# EAGLE design ou6_cs-base V1.0 (EAGLE 7.6.0)
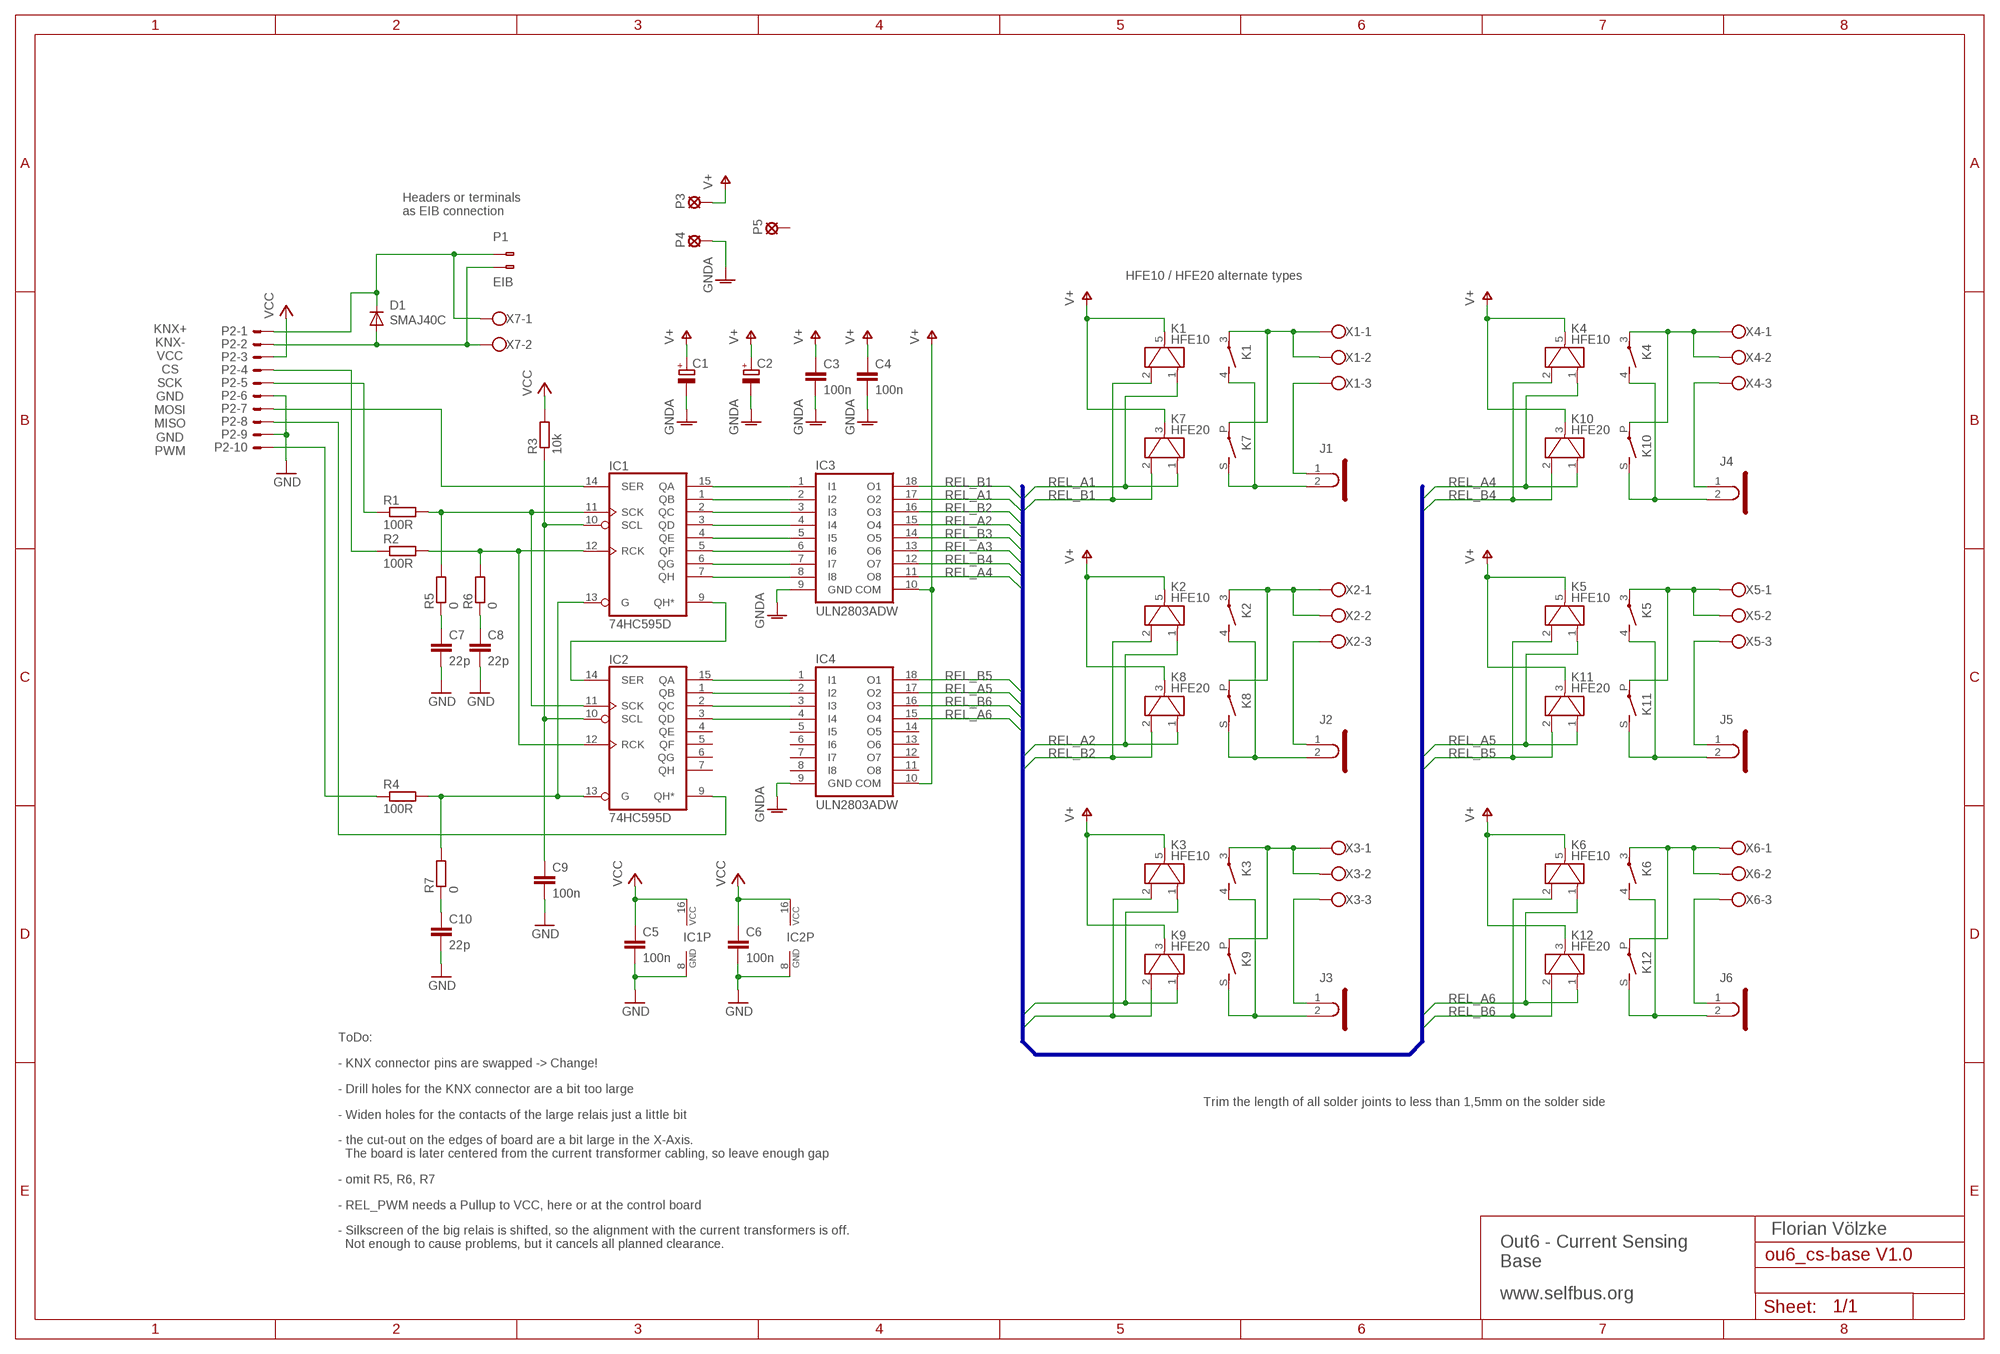
[diagram p0: schematic, sheet 1]

## Parts
C1  CPOL-EUE5-13-20  [E5-13-20]
C2  CPOL-EUE5-13-20R  [E5-13-20R]
C3  100n  C-EUC0805M  [R0805M]
C4  100n  C-EUC0805M  [R0805M]
C5  100n  C-EUC0805M  [R0805M]
C6  100n  C-EUC0805M  [R0805M]
C7  22p  C-EUC0805M  [R0805M]
C8  22p  C-EUC0805M  [R0805M]
C9  100n  C-EUC0805M  [R0805M]
C10  22p  C-EUC0805M  [R0805M]
D1  SMAJ40C  D-SMB  [SMB]
IC1  74HC595D  [SO16]
IC2  74HC595D  [SO16]
IC3  ULN2803ADW  [SO18W]
IC4  ULN2803ADW  [SO18W]
J1  IXFORMER_PRIMONLY  [IXFORMERANTIPART]
J2  IXFORMER_PRIMONLY  [IXFORMERANTIPART]
J3  IXFORMER_PRIMONLY  [IXFORMERANTIPART]
J4  IXFORMER_PRIMONLY  [IXFORMERANTIPART]
J5  IXFORMER_PRIMONLY  [IXFORMERANTIPART]
J6  IXFORMER_PRIMONLY  [IXFORMERANTIPART]
K1  HFE10  BISTABLE2C_PCB_SNGLPINHFE10  [PCB_REL_BIG_POWER_NO]
K2  HFE10  BISTABLE2C_PCB_SNGLPINHFE10  [PCB_REL_BIG_POWER_NO]
K3  HFE10  BISTABLE2C_PCB_SNGLPINHFE10  [PCB_REL_BIG_POWER_NO]
K4  HFE10  BISTABLE2C_PCB_SNGLPINHFE10  [PCB_REL_BIG_POWER_NO]
K5  HFE10  BISTABLE2C_PCB_SNGLPINHFE10  [PCB_REL_BIG_POWER_NO]
K6  HFE10  BISTABLE2C_PCB_SNGLPINHFE10  [PCB_REL_BIG_POWER_NO]
K7  HFE20  BISTABLE2C_PCB_SNGLPINHFE20  [PCB_REL_HP_NO_SNGLPIN]
K8  HFE20  BISTABLE2C_PCB_SNGLPINHFE20  [PCB_REL_HP_NO_SNGLPIN]
K9  HFE20  BISTABLE2C_PCB_SNGLPINHFE20  [PCB_REL_HP_NO_SNGLPIN]
K10  HFE20  BISTABLE2C_PCB_SNGLPINHFE20  [PCB_REL_HP_NO_SNGLPIN]
K11  HFE20  BISTABLE2C_PCB_SNGLPINHFE20  [PCB_REL_HP_NO_SNGLPIN]
K12  HFE20  BISTABLE2C_PCB_SNGLPINHFE20  [PCB_REL_HP_NO_SNGLPIN]
P1  EIB  [BUSKLEMME243-724]
P2  ML10E  [ML10]
P3  SE1.5  [SE15]
P4  SE1.5  [SE15]
P5  SE1.5  [SE15]
R1  100R  R-EU_R0805M  [R0805M]
R2  100R  R-EU_R0805M  [R0805M]
R3  10k  R-EU_R0805M  [R0805M]
R4  100R  R-EU_R0805M  [R0805M]
R5  0  R-EU_R0805M  [R0805M]
R6  0  R-EU_R0805M  [R0805M]
R7  0  R-EU_R0805M  [R0805M]
X1  KLEMME3POL5_08  [KLEMME3POL5_08]
X2  KLEMME3POL5_08  [KLEMME3POL5_08]
X3  KLEMME3POL5_08  [KLEMME3POL5_08]
X4  KLEMME3POL5_08  [KLEMME3POL5_08]
X5  KLEMME3POL5_08  [KLEMME3POL5_08]
X6  KLEMME3POL5_08  [KLEMME3POL5_08]
X7  KLEMME2POL5_08  [KLEMME2POL5_08]

## Nets
GND: C5.2 C6.2 C7.2 C8.2 C9.2 C10.2 IC1.8(GND) IC2.8(GND) P2.6 P2.9
GNDA: C1.- C2.- C3.2 C4.2 IC3.9(GND) IC4.9(GND) P4.MP
N$1: IC1.9(QH*) IC2.14(SER)
N$2: IC1.11(SCK) IC2.11(SCK) R1.2 R5.2
N$3: IC1.12(RCK) IC2.12(RCK) R2.2 R6.2
N$4: IC1.14(SER) P2.7
N$5: IC1.13(G) IC2.13(G) R4.2 R7.2
N$6: K2.3(P) K8.P X2.P$1 X2.P$2
N$7: J3.2 K3.4(S) K9.S
N$8: J2.2 K2.4(S) K8.S
N$9: J1.2 K1.4(S) K7.S
N$10: J2.1 X2.P$3
N$11: J1.1 X1.P$3
N$12: K1.3(P) K7.P X1.P$1 X1.P$2
N$13: IC2.9(QH*) P2.8
N$14: K3.3(P) K9.P X3.P$1 X3.P$2
N$15: K4.3(P) K10.P X4.P$1 X4.P$2
N$16: J3.1 X3.P$3
N$17: IC1.15(QA) IC3.1(I1)
N$18: K5.3(P) K11.P X5.P$1 X5.P$2
N$19: IC1.1(QB) IC3.2(I2)
N$20: K6.3(P) K12.P X6.P$1 X6.P$2
N$21: IC1.2(QC) IC3.3(I3)
N$22: J6.1 X6.P$3
N$23: J6.2 K6.4(S) K12.S
N$24: J5.2 K5.4(S) K11.S
N$25: J4.2 K4.4(S) K10.S
N$26: IC1.3(QD) IC3.4(I4)
N$27: IC1.4(QE) IC3.5(I5)
N$28: IC1.5(QF) IC3.6(I6)
N$29: IC1.6(QG) IC3.7(I7)
N$30: J5.1 X5.P$3
N$31: IC1.7(QH) IC3.8(I8)
N$32: IC2.15(QA) IC4.1(I1)
N$33: J4.1 X4.P$3
N$34: IC2.1(QB) IC4.2(I2)
N$35: IC2.2(QC) IC4.3(I3)
N$36: IC2.3(QD) IC4.4(I4)
N$37: C9.1 IC1.10(SCL) IC2.10(SCL) R3.1
N$38: P2.5 R1.1
N$39: P2.4 R2.1
N$40: D1.1(C) P1.1(B-1) P2.1 X7.P$1
N$41: P2.10 R4.1
N$42: D1.2(A) P1.2(B-2) P2.2 X7.P$2
N$43: C7.1 R5.1
N$44: C8.1 R6.1
N$45: C10.1 R7.1
REL_A1: IC3.17(O2) K1.1 K7.1
REL_A2: IC3.15(O4) K2.1 K8.1
REL_A3: IC3.13(O6) K3.1 K9.1
REL_A4: IC3.11(O8) K4.1 K10.1
REL_A5: IC4.17(O2) K5.1 K11.1
REL_A6: IC4.15(O4) K6.1 K12.1
REL_B1: IC3.18(O1) K1.2 K7.2
REL_B2: IC3.16(O3) K2.2 K8.2
REL_B3: IC3.14(O5) K3.2 K9.2
REL_B4: IC3.12(O7) K4.2 K10.2
REL_B5: IC4.18(O1) K5.2 K11.2
REL_B6: IC4.16(O3) K6.2 K12.2
V+: C1.+ C2.+ C3.1 C4.1 IC3.10(COM) IC4.10(COM) K1.5 K2.5 K3.5 K4.5 K5.5 K6.5 K7.3 K8.3 K9.3 K10.3 K11.3 K12.3 P3.MP
VCC: C5.1 C6.1 IC1.16(VCC) IC2.16(VCC) P2.3 R3.2
Unconnected: IC2.4(QE) IC2.5(QF) IC2.6(QG) IC2.7(QH) IC4.5(I5) IC4.6(I6) IC4.7(I7) IC4.8(I8) IC4.11(O8) IC4.12(O7) IC4.13(O6) IC4.14(O5) P5.MP

## Buses
REL_A[1..6],REL_B[1..6]

## Notes on the sheet
- Headers or terminals
  as EIB connection
- HFE10 / HFE20 alternate types
- KNX+
  KNX-
  VCC
  CS
  SCK
  GND
  MOSI
  MISO
  GND
  PWM
- ToDo:
- - KNX connector pins are swapped -> Change!
- - Drill holes for the KNX connector are a bit too large
- Trim the length of all solder joints to less than 1,5mm on the solder side
- - Widen holes for the contacts of the large relais just a little bit
- - the cut-out on the edges of board are a bit large in the X-Axis.
    The board is later centered from the current transformer cabling, so leave enough gap
- - omit R5, R6, R7
- - REL_PWM needs a Pullup to VCC, here or at the control board
- Out6 - Current Sensing
  Base
- Florian Völzke
- - Silkscreen of the big relais is shifted, so the alignment with the current transformers is off.
    Not enough to cause problems, but it cancels all planned clearance.
- www.selfbus.org

## Library data of the parts
C1 C2 = rcl:CPOL-EU: POLARIZED CAPACITOR, European symbol
C3-C10 = rcl:C-EU: CAPACITOR, European symbol
D1 = semicon-smd-ipc:D-: DIODE unfilled
IC1 IC2 = 74xx-eu:74*595: 8-bit SHIFT REGISTER, output latch
IC3 IC4 = uln-udn:ULN2803A: DRIVER ARRAY
J1-J6 = eigene:IXFORMER_PRIMONLY
K1-K12 = relay:BISTABLE2C_PCB_SNGLPIN
P1 = con-wago:EIB
P2 = con-harting-ml:ML10?E: HARTING; OC_FARNELL: unknown; OC_NEWARK: unknown
P3-P5 = solpad:SE: SOLDER PAD drill in mm
R1-R7 = rcl:R-EU_: RESISTOR, European symbol
X1-X6 = eigene:KLEMME3POL5_08
X7 = eigene:KLEMME2POL5_08

## Board
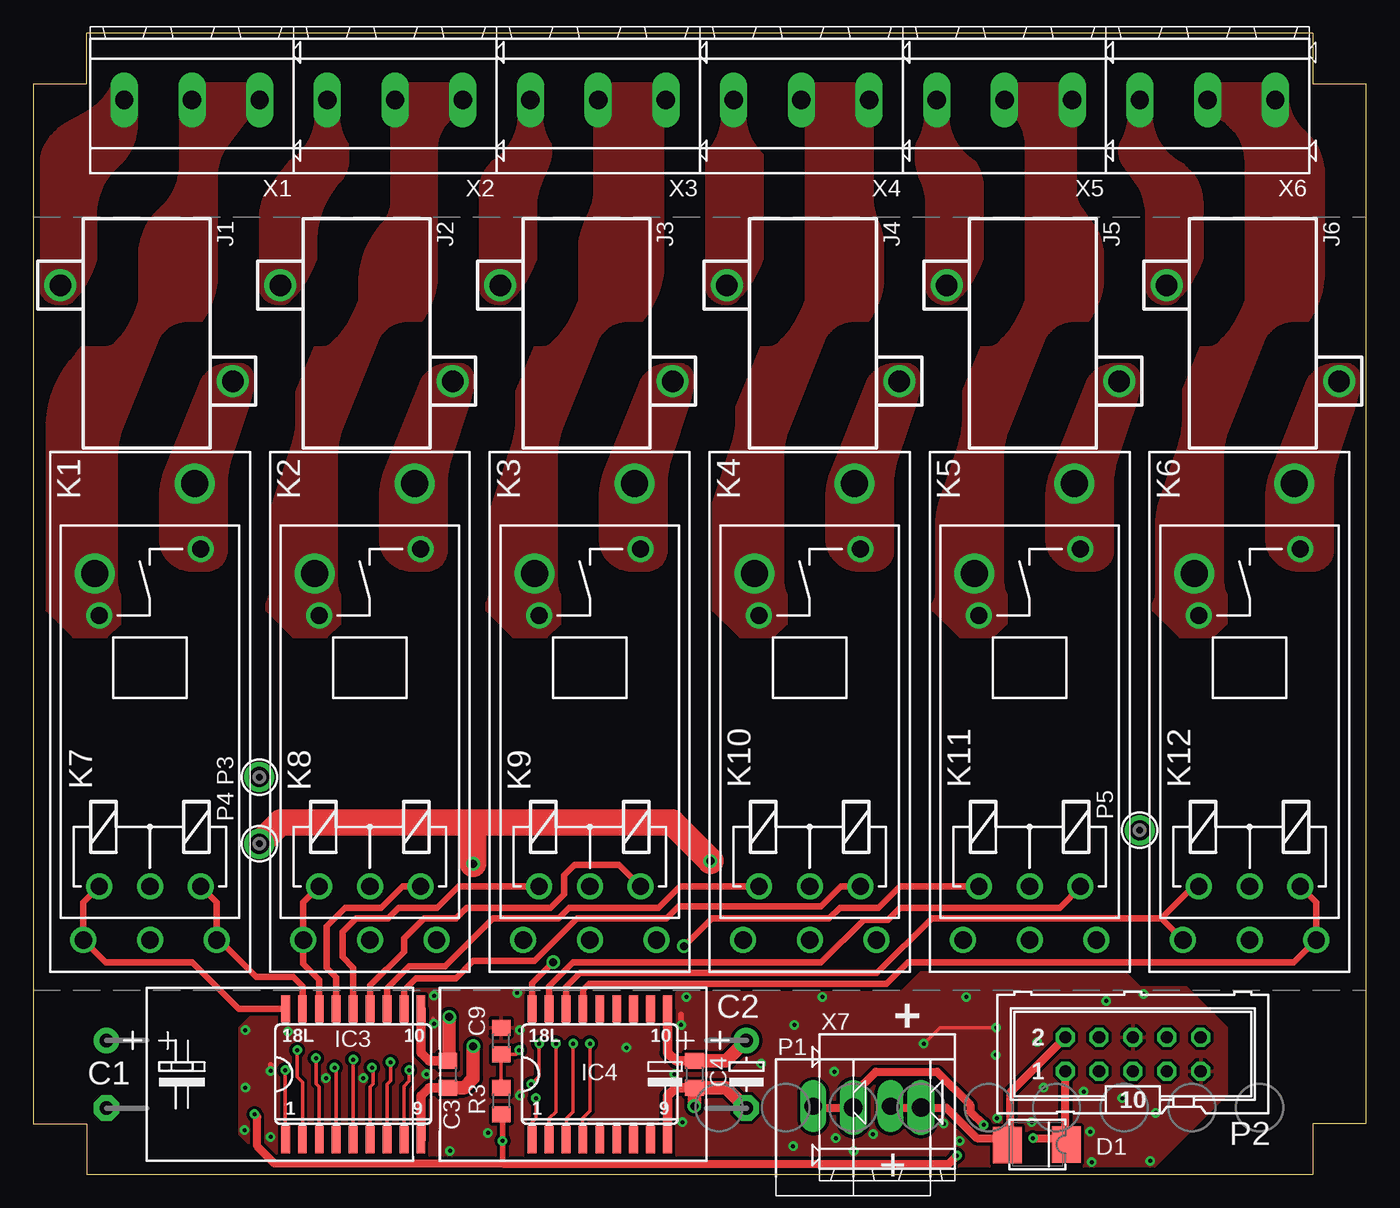
[diagram p1: board, top side]
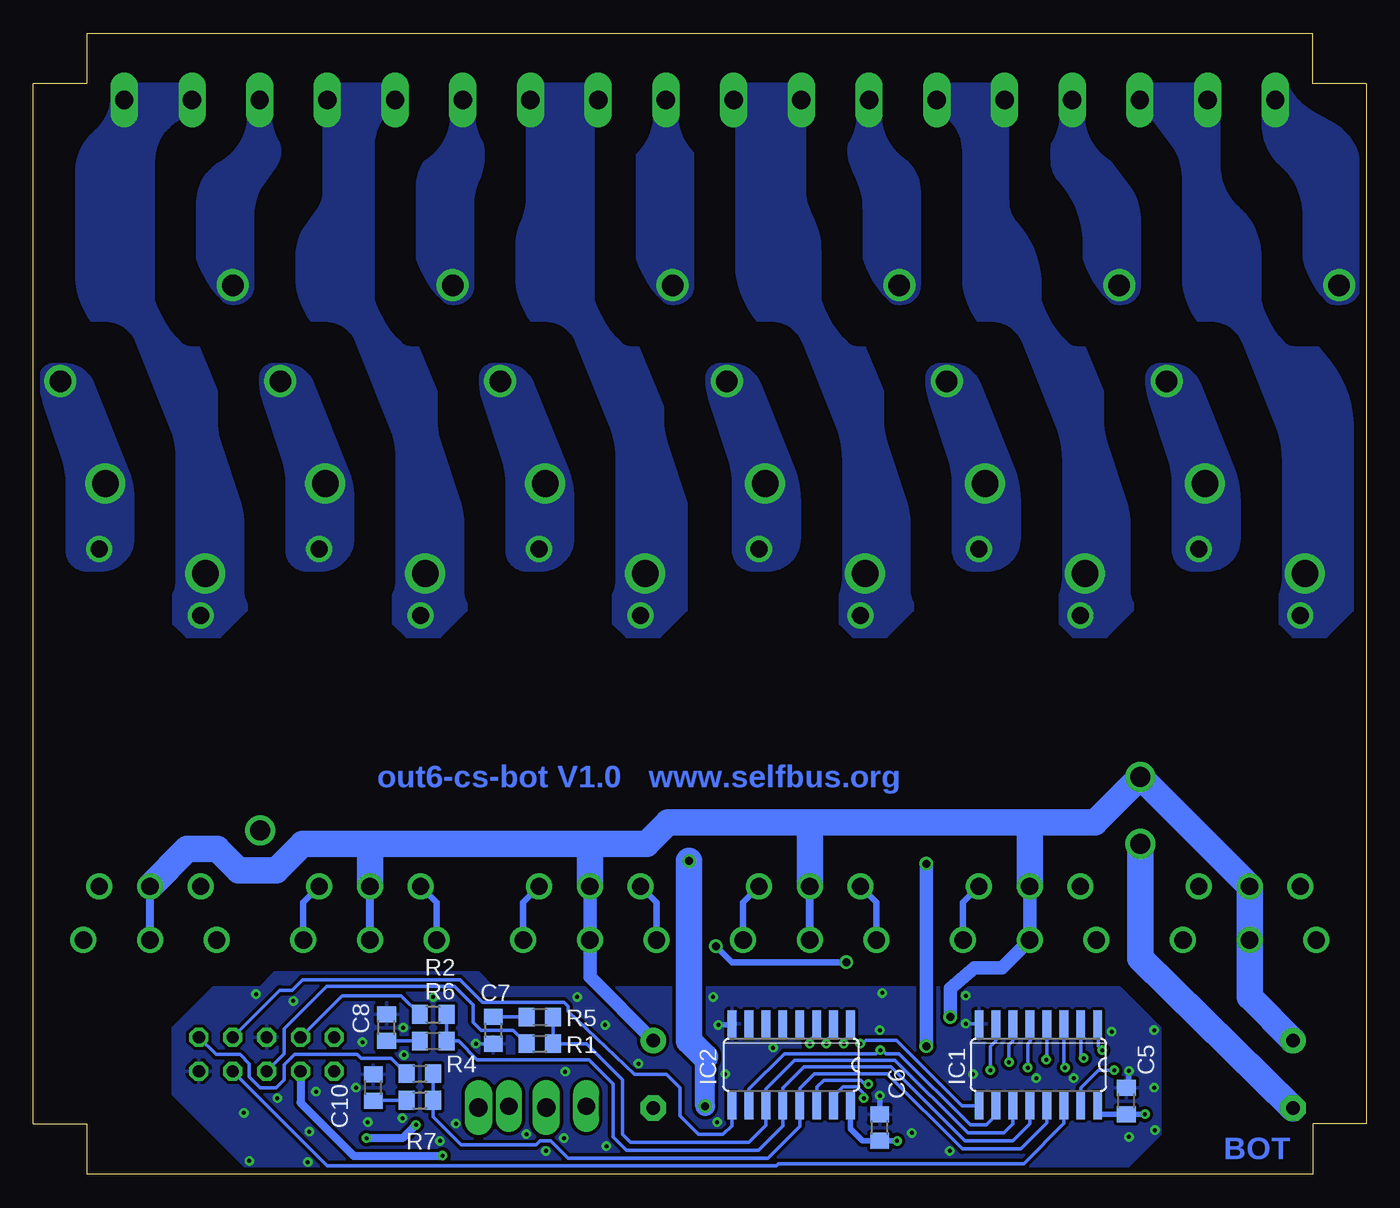
[diagram p2: board, bottom side, seen from below]

Size 100 x 85.6 mm. Coordinates in mm from the lower left corner, seen from the top.
Outline: 4,0 96,0 96,3.8 100,3.8 100,81.8 96,81.8 96,85.6 4,85.6 4,81.8 0,81.8 0,3.8 4,3.8 4,0
Copper layers (1*16): Top 0.035mm / dielectric 1.5mm / Bottom 0.035mm
Design rules "default *": minimum track width 0.2mm, minimum drill 0.3mm, track to track 0.25mm, track to pad 0.25mm, pad to pad 0.25mm, via to via 0.25mm, smd to smd 0.2mm, copper to edge 0.5mm, drill to drill 0.5mm, minimum pad ring 10mil, minimum via ring 8mil, stop-mask expansion 4mil, vias tented up to drill 0.6mm, thermal gap 10mil

### Footprints (pad centres in the part's own frame; a part is rotated, then mirrored left to right if it is on the bottom)
E5-13-20 = drill 1.016 pad 1.905: + -2.54,0 | drill 1.016 pad 1.905 octagon: - 2.54,0
E5-13-20R = drill 1.016 pad 1.905: + 2.54,0 | drill 1.016 pad 1.905 octagon: - -2.54,0
R0805M = smd 1.2 x 1.4: 1 -1,0; 2 1,0
SMB = smd 2.159 x 2.743: 1 -2.311,-0.127; 2 2.108,-0.102
SO16 = smd 0.66 x 2.032: 1 -4.445,-3.073; 2 -3.175,-3.073; 3 -1.905,-3.073; 4 -0.635,-3.073; 5 0.635,-3.073; 6 1.905,-3.073; 7 3.175,-3.073; 8 4.445,-3.073; 9 4.445,3.073; 10 3.175,3.073; 11 1.905,3.073; 12 0.635,3.073; 13 -0.635,3.073; 14 -1.905,3.073; 15 -3.175,3.073; 16 -4.445,3.073
SO18W = smd 0.66 x 2.032: 1 -5.08,-4.902; 2 -3.81,-4.902; 3 -2.54,-4.902; 4 -1.27,-4.902; 5 0,-4.902; 6 1.27,-4.902; 7 2.54,-4.902; 8 3.81,-4.902; 9 5.08,-4.902; 10 5.08,4.902; 11 3.81,4.902; 12 2.54,4.902; 13 1.27,4.902; 14 0,4.902; 15 -1.27,4.902; 16 -2.54,4.902; 17 -3.81,4.902; 18 -5.08,4.902
IXFORMERANTIPART = drill 1.6: 1 -3.6,-6.465; 2 3.6,6.465
PCB_REL_BIG_POWER_NO = drill 1.3: 1 -17.125,-5; 2 -17.125,5; 5 -17.125,0 | drill 2: 3 10.375,4.15; 4 17.125,-3.35
PCB_REL_HP_NO_SNGLPIN = drill 1.3: 1 -12.7,-3.81; 2 -12.7,3.81; 3 -12.7,0; P 7.62,3.81; S 12.6,-3.81
BUSKLEMME243-724 = drill 1.3 long: 1 -2.9,0; 2 2.9,0
ML10 = drill 0.914 octagon: 1 -5.08,-1.27; 2 -5.08,1.27; 3 -2.54,-1.27; 4 -2.54,1.27; 5 0,-1.27; 6 0,1.27; 7 2.54,-1.27; 8 2.54,1.27; 9 5.08,-1.27; 10 5.08,1.27
SE15 = drill 1.5: MP 0,0
KLEMME3POL5_08 = drill 1.38 long: P$1 -5.08,0; P$2 0,0; P$3 5.08,0
KLEMME2POL5_08 = drill 1.38 long: P$1 -2.54,0; P$2 2.54,0

### Placement (x,y rotation side)
C1  5.5,7.5 270 top
C2  53.5,7.5 90 top
C3  31.1,7.5 270 top
C4  49.6,7.5 270 top
C5  18,5.5 90 bottom
C6  36.5,3.5 90 bottom
C7  65.5,10.8 270 bottom
C8  73.5,11 90 bottom
C9  35.1,10 90 top
C10  74.5,6.5 90 bottom
D1  75.2,2.1 180 top
IC1  24.59,8.2 180 bottom
IC2  43.13,8.2 180 bottom
IC3  24,7.5 0 top
IC4  42.5,7.5 0 top
J1  8.5,63.1 270 top
J2  25,63.1 270 top
J3  41.5,63.1 270 top
J4  58.5,63.1 270 top
J5  75,63.1 270 top
J6  91.5,63.1 270 top
K1  8.75,34.7 90 top
K2  25.25,34.7 90 top
K3  41.75,34.7 90 top
K4  58.25,34.7 90 top
K5  74.75,34.7 90 top
K6  91.25,34.7 90 top
K7  8.75,34.3 90 top
K8  25.25,34.3 90 top
K9  41.75,34.3 90 top
K10  58.25,34.3 90 top
K11  74.75,34.3 90 top
K12  91.25,34.3 90 top
P1  61.42,5.1 0 top
P2  82.5,9 0 top
P3  16.95,29.8 0 top
P4  16.95,24.8 0 top
P5  83,25.8 0 top
R1  62,9.8 0 bottom
R2  70,12 0 bottom
R3  35.1,5.5 270 top
R4  71,7.55 0 bottom
R5  62,11.8 0 bottom
R6  70,10 0 bottom
R7  71,5.55 0 bottom
X1  11.9,80.6 180 top
X2  27.14,80.6 180 top
X3  42.38,80.6 180 top
X4  57.62,80.6 180 top
X5  72.86,80.6 180 top
X6  88.1,80.6 180 top
X7  64.06,5 0 top

### Tracks (layer width: path | path; a pad name or v marks a point on that pad's centre or on a via)
GND  (via drill 0.3)
  Top 0.25: v66.8,9.8 68,11 v72.25,11 | v30.05,11.3 30,11.7
  Top 0.4: v36.5,5.9 36.5,6.2 | v17.8,7.75 17.8,8.2 | v48.6,11.2 48.6,12
  Bottom 0.25: C8.2 73.4,12 | v75.8,6.5 75.7,6.5 | 74.7,7.5 C10.2 74.1,7.1 | C7.2 v66.8,9.8 | IC1.8 29.07,11.3 v30.05,11.3
  Bottom 0.4: C6.2 v36.5,5.9 | C5.2 17.8,6.7 v17.8,7.75 | IC2.8 47.65,11.2 v48.6,11.2
  other vias: 15.85,3.3 17.8,2.8 15.9,10.8 21.95,7.2 19.1,10.7 24.75,7.2 29.5,7.5 30.05,13.4 48.7,3.9 48.1,7.5 44.5,9.5 34.1,3.1 31.25,1.75 36.3,13.6 49,13.3 59.2,13.3 57.1,11.2 54.6,8.3 61.55,1.75 81.7,5.7 83.3,13.5 80.5,13 72.2,8.95 60.1,7.7 60.2,2.7 57,2.1 79.3,3.2 79.4,0.9 83.8,1 84.2,4.6 78.8,6.2 63,3 68.3,3.8 69.5,2.5 74.9,3.9 75.3,9.9 70,13.3 72.3,4.2 36.5,10.8 15.9,6.5
  pour Top (isolate 0.25): 18.5,14 15.5,11 15.5,3 18,0.5 84,0.5 89.5,6 89.5,11 86.5,14 83,14 81.9,15.1 66.6,15.1 65.1,13.6 48.3,13.6 48.2,13.5 41.6,13.5 41.1,13.8
  pour Bottom (isolate 0.25): 15.5,11 15.5,3 18,0.5 84,0.5 89.5,6 89.5,11 86.5,14 83,14 81.9,15.1 66.6,15.1 65.5,14 18.5,14
GNDA  (via drill 0.6)
  Top 0.7: IC4.9 47.58,5.88 48.2,6.5 C4.2 | IC3.9 29.08,5.88 29.7,6.5 C3.2
  Top 1: C3.2 32.3,6.5 33,7.2 v33,9.6 | C2.- 51.96,6.5 C4.2 v49.6,5.1
  Top 2: P4.MP 18.55,26.4 33,26.4 | 33,26.4 47.9,26.4 v50.8,23.5 | v33,23.3 33,26.4
  Bottom 1: v33,9.6 v33,23.3
  Bottom 1.5: v49.6,5.1 49.6,8.8
  Bottom 2: C1.- 16.95,16.21 P4.MP | 49.6,8.8 50.8,10 v50.8,23.5
N$1  (via drill 0.3)
  Top 0.25: v37.35,6.75 37.95,7.35 v37.95,9.8
  Bottom 0.25: IC2.14 41.2,5.16 41.2,6.55 40.7,7.05 37.9,7.05 37.6,6.75 v37.35,6.75 | IC1.9 30.33,5.13 35.25,10.05 37.55,10.05 37.8,9.8 v37.95,9.8
N$2
  Bottom 0.25: R5.2 R1.2 58.5,9.8 55.8,7.1 55.8,3 55.2,2.4 46.3,2.4 45.04,3.66 IC2.11 45.04,6.41 42.9,8.55 35.35,8.55 29.9,3.1 27.2,3.1 26.5,3.8 IC1.11
N$3
  Bottom 0.25: R2.2 R6.2 68.1,10 66.7,8.6 58.3,8.6 56.5,6.8 56.5,2.8 55.5,1.8 45.6,1.8 43.77,3.63 IC2.12 43.77,6.48 42.2,8.05 35.65,8.05 30.1,2.5 26.5,2.5 25.23,3.77 IC1.12
N$4
  Bottom 0.25: P2.7 77.96,0.65 44.25,0.65 44.1,0.8 25.7,0.8 22.69,3.81 IC1.14
N$5
  Bottom 0.25: R4.2 R7.2 70,4.3 67.9,2.2 62.3,2.2 62,2.5 61.2,2.5 59.9,1.2 44.9,1.2 42.5,3.6 IC2.13 42.5,6.45 41.4,7.55 35.95,7.55 30.3,1.9 25.9,1.9 23.96,3.84 IC1.13
N$6
  pour Top (isolate 3.1, rank 2, no thermals): 17.5,42.3 19.5,40.3 22,40.3 23,41.3 23,49.3 24.5,50.8 24.5,55.8 26.1,60 26.9,61.3 28.6,63.4 arc46 30.3,68 30.3,70.5 33.2,73.5 33.2,81.8 26.2,81.8 26.2,75.5 23.5,72.8 23.5,67.8 17.5,53.3
  pour Bottom (isolate 3.1, rank 2, no thermals): 17.5,42.3 19.5,40.3 22,40.3 23,41.3 23,49.3 24.5,50.8 24.5,55.8 26.1,60 26.9,61.3 28.6,63.4 arc46 30.3,68 30.3,70.5 33.2,73.5 33.2,81.8 26.2,81.8 26.2,75.5 23.5,72.8 23.5,67.8 17.5,53.3
N$7
  pour Top (isolate 0.4, no thermals): 47.5,46.8 arc-94 45.9,45.3 44.9,45.3 arc-90 42.5,47.7 42.5,50.5 arc-24 42.9,52.8 45.5,59.3 arc-68 47.7,60.8 48.4,60.8 arc-90 49.5,59.7 arc-19 49.2,57.9 47.8,53.7 arc19 47.5,51.7
  pour Bottom (isolate 0.4, no thermals): 47.5,46.8 arc-94 45.9,45.3 44.9,45.3 arc-90 42.5,47.7 42.5,50.5 arc-24 42.9,52.8 45.5,59.3 arc-68 47.7,60.8 48.4,60.8 arc-90 49.5,59.7 arc-19 49.2,57.9 47.8,53.7 arc19 47.5,51.7
N$8
  pour Top (isolate 0.4, no thermals): 31,46.8 arc-94 29.4,45.3 28.4,45.3 arc-90 26,47.7 26,50.5 arc-24 26.4,52.8 29,59.3 arc-68 31.2,60.8 31.9,60.8 arc-90 33,59.7 arc-19 32.7,57.9 31.3,53.7 arc19 31,51.7
  pour Bottom (isolate 0.4, no thermals): 31,46.8 arc-94 29.4,45.3 28.4,45.3 arc-90 26,47.7 26,50.5 arc-24 26.4,52.8 29,59.3 arc-68 31.2,60.8 31.9,60.8 arc-90 33,59.7 arc-19 32.7,57.9 31.3,53.7 arc19 31,51.7
N$9
  pour Top (isolate 0.4, no thermals): 14.5,46.8 arc-94 12.9,45.3 11.9,45.3 arc-90 9.5,47.7 9.5,50.5 arc-24 9.9,52.8 12.5,59.3 arc-68 14.7,60.8 15.4,60.8 arc-90 16.5,59.7 arc-19 16.2,57.9 14.8,53.7 arc19 14.5,51.7
  pour Bottom (isolate 0.4, no thermals): 14.5,46.8 arc-94 12.9,45.3 11.9,45.3 arc-90 9.5,47.7 9.5,50.5 arc-24 9.9,52.8 12.5,59.3 arc-68 14.7,60.8 15.4,60.8 arc-90 16.5,59.7 arc-19 16.2,57.9 14.8,53.7 arc19 14.5,51.7
N$10
  pour Top (isolate 3.1, no thermals): 23,81.8 21,81.8 21,78.7 20.3,77.4 17.8,74.1 arc37 17,71.7 17,66.6 arc90 18.4,65.3 18.6,65.3 arc37 19.2,65.5 arc26 21.2,68.7 21.2,70.2 arc-41 23,74.5 arc36 23.6,75.9 arc17 23.5,77.7 23.3,78.1
  pour Bottom (isolate 3.1, no thermals): 23,81.8 21,81.8 21,78.7 20.3,77.4 17.8,74.1 arc37 17,71.7 17,66.6 arc90 18.4,65.3 18.6,65.3 arc37 19.2,65.5 arc26 21.2,68.7 21.2,70.2 arc-41 23,74.5 arc36 23.6,75.9 arc17 23.5,77.7 23.3,78.1
N$11
  pour Top (isolate 0.4, no thermals): 7.7,81.8 6,81.8 arc-37 3.7,79.5 2.8,79 arc65 0.5,75.5 0.5,66.6 arc90 1.9,65.3 2.3,65.3 arc46 3,65.6 arc30 4.7,68.7 4.7,71.7 arc-53 6.3,75.6 arc58 7.7,79.7
  pour Bottom (isolate 0.4, no thermals): 7.7,81.8 6,81.8 arc-37 3.7,79.5 2.8,79 arc65 0.5,75.5 0.5,66.6 arc90 1.9,65.3 2.3,65.3 arc46 3,65.6 arc30 4.7,68.7 4.7,71.7 arc-53 6.3,75.6 arc58 7.7,79.7
N$12
  pour Top (isolate 0.4, rank 2, no thermals): 3,40.3 1,42.3 1,56.3 arc-40 3.2,61.5 3.6,62 3.5,40.3
  pour Top (isolate 3.1, rank 2, no thermals): 3,40.3 5.5,40.3 6.5,41.3 6.5,49.3 8,50.8 8,55.8 9.6,60 10.4,61.3 12.1,63.4 arc46 13.8,68 15,73.1 17.9,76.6 17.9,81.8 10.9,81.8 9.2,74.9 7.5,73.4 6.9,65.8 3,61.3
  pour Bottom (isolate 3.1, rank 2, no thermals): 3,40.3 5.5,40.3 6.5,41.3 6.5,49.3 8,50.8 8,55.8 9.6,60 10.4,61.3 12.1,63.4 arc46 13.8,68 15,73.1 17.9,76.6 17.9,81.8 10.9,81.8 9.2,74.9 7.5,73.4 6.9,65.8 3,61.3
  pour Bottom (isolate 0.4, rank 2, no thermals): 3,40.3 1,42.3 1,56.3 arc-40 3.2,61.5 3.6,62 3.5,40.3
N$13
  Bottom 0.25: IC2.9 47.6,3.65 48.25,3 50.1,3 51.5,4.4 51.5,6.5 52.5,7.5 54.9,7.5 59.9,12.2 59.9,12.6 60.2,12.9 66.3,12.9 68,14.6 79.8,14.6 80.6,13.8 81.51,13.8 P2.8
N$14
  pour Top (isolate 3.1, rank 2, no thermals): 34,42.3 36,40.3 38.5,40.3 39.5,41.3 39.5,49.3 41,50.8 41,55.8 42.6,60 43.4,61.3 45.1,63.4 arc46 47.3,68.7 47.3,70.7 48.4,72.1 48.4,81.8 41.4,81.8 41.5,74.3 40,72.8 40,67.8 34,53.3
  pour Bottom (isolate 3.1, rank 2, no thermals): 34,42.3 36,40.3 38.5,40.3 39.5,41.3 39.5,49.3 41,50.8 41,55.8 42.6,60 43.4,61.3 45.1,63.4 arc46 47.3,68.7 47.3,70.7 48.4,72.1 48.4,81.8 41.4,81.8 41.5,74.3 40,72.8 40,67.8 34,53.3
N$15
  pour Top (isolate 3.1, rank 2, no thermals): 51,42.3 53,40.3 55.5,40.3 56.5,41.3 56.5,49.3 58,50.8 58,55.8 59.6,60 60.4,61.3 62.1,63.4 arc46 63.8,68 63.8,79.1 63.6,81.8 58.4,81.8 57,80.6 57,67.8 51,53.3
  pour Bottom (isolate 3.1, rank 2, no thermals): 51,42.3 53,40.3 55.5,40.3 56.5,41.3 56.5,49.3 58,50.8 58,55.8 59.6,60 60.4,61.3 62.1,63.4 arc46 63.8,68 63.8,79.1 63.6,81.8 58.4,81.8 57,80.6 57,67.8 51,53.3
N$16
  pour Top (isolate 3.1, no thermals): 38.3,81.4 35.7,81.4 35.7,77.3 34.9,76.3 arc57 33.5,73.7 33.5,66.7 arc90 34.9,65.3 35.1,65.3 arc37 35.7,65.5 arc26 37.7,68.7 37.7,72.2 arc-31 38.4,75.1 38.7,75.9 arc47 38.6,77.9
  pour Bottom (isolate 3.1, no thermals): 38.3,81.4 35.7,81.4 35.7,77.3 34.9,76.3 arc57 33.5,73.7 33.5,66.7 arc90 34.9,65.3 35.1,65.3 arc37 35.7,65.5 arc26 37.7,68.7 37.7,72.2 arc-31 38.4,75.1 38.7,75.9 arc47 38.6,77.9
N$17  (via drill 0.3)
  Top 0.25: v18.9,7.8 18.9,2.62 IC3.1
  Bottom 0.25: IC1.15 21.42,6.48 20.1,7.8 v18.9,7.8
N$18
  pour Top (isolate 3.1, rank 2, no thermals): 67.5,42.3 69.5,40.3 72,40.3 73,41.3 73,49.3 74.5,50.8 74.5,55.8 76.1,60 76.9,61.3 78.6,63.4 arc46 80.3,68 80.3,74.9 arc19 79.7,77.1 79.2,78 79,81.8 72,81.8 72,78.3 74.4,74.9 74.4,68.7 72.7,65.8 67.5,53.3
  pour Bottom (isolate 3.1, rank 2, no thermals): 67.5,42.3 69.5,40.3 72,40.3 73,41.3 73,49.3 74.5,50.8 74.5,55.8 76.1,60 76.9,61.3 78.6,63.4 arc46 80.3,68 80.3,74.9 arc19 79.7,77.1 79.2,78 79,81.8 72,81.8 72,78.3 74.4,74.9 74.4,68.7 72.7,65.8 67.5,53.3
N$19  (via drill 0.3)
  Top 0.25: IC3.2 20.19,6.91 19.8,7.3 v19.8,9.3
  Bottom 0.25: v19.8,9.3 20.1,9.6 20.1,11.22 IC1.1
N$20
  pour Top (isolate 3.1, rank 2, no thermals): 84,42.3 86,40.3 88.5,40.3 89.5,41.3 89.5,49.3 91,50.8 91,55.8 92.6,60 93.4,61.3 95.1,63.4 arc46 96.8,68 96.8,75.1 94.1,78.4 94.1,81.8 87.2,81.8 87.2,78.7 90.9,73.5 90.9,68.8 88.2,63.5 84,53.3
  pour Top (no thermals): 91,81.8 94.1,81.8 94.1,80.9 arc48 95.4,78.2 arc-43 96.8,75.4 96.8,74.3 91,74.3
  pour Bottom (isolate 3.1, rank 2, no thermals): 84,42.3 86,40.3 88.5,40.3 89.5,41.3 89.5,49.3 91,50.8 91,55.8 92.6,60 93.4,61.3 95.1,63.4 arc46 96.8,68 96.8,75.1 94.1,78.4 94.1,81.8 87.2,81.8 87.2,78.7 90.9,73.5 90.9,68.8 88.2,63.5 84,53.3
  pour Bottom (no thermals): 91,81.8 94.1,81.8 94.1,80.9 arc48 95.4,78.2 arc-43 96.8,75.4 96.8,74.3 91,74.3
N$21  (via drill 0.3)
  Top 0.25: IC3.3 21.46,6.54 21.2,6.8 v21.2,8.7
  Bottom 0.25: v21.2,8.7 21.42,8.92 IC1.2
N$22
  pour Top (isolate 3.1, no thermals): 84,81.4 82.1,81.4 82.1,79.2 81.6,77.5 arc50 81.8,75.7 83,74 arc-31 83.5,71.6 83.5,66.7 arc90 84.9,65.3 85.1,65.3 arc37 85.7,65.5 arc26 87.7,68.7 87.7,72.9 arc53 86.3,75.7 85.5,76.3 84.2,78.3
  pour Bottom (isolate 3.1, no thermals): 84,81.4 82.1,81.4 82.1,79.2 81.6,77.5 arc50 81.8,75.7 83,74 arc-31 83.5,71.6 83.5,66.7 arc90 84.9,65.3 85.1,65.3 arc37 85.7,65.5 arc26 87.7,68.7 87.7,72.9 arc53 86.3,75.7 85.5,76.3 84.2,78.3
N$23
  pour Top (isolate 0.4, no thermals): 97.5,46.8 arc-94 95.9,45.3 94.9,45.3 arc-90 92.5,47.7 92.5,50.5 arc-24 92.9,52.8 95.5,59.3 arc-68 97.7,60.8 98.4,60.8 arc-90 99.5,59.7 arc-19 99.2,57.9 97.8,53.7 arc19 97.5,51.7
  pour Bottom (isolate 0.4, no thermals): 97.5,46.8 arc-94 95.9,45.3 94.9,45.3 arc-90 92.5,47.7 92.5,50.5 arc-24 92.9,52.8 95.5,59.3 arc-68 97.7,60.8 98.4,60.8 arc-90 99.5,59.7 arc-19 99.2,57.9 97.8,53.7 arc19 97.5,51.7
N$24
  pour Top (isolate 0.4, no thermals): 81,46.8 arc-94 79.4,45.3 78.4,45.3 arc-90 76,47.7 76,50.5 arc-24 76.4,52.8 79,59.3 arc-68 81.2,60.8 81.9,60.8 arc-90 83,59.7 arc-19 82.7,57.9 81.3,53.7 arc19 81,51.7
  pour Bottom (isolate 0.4, no thermals): 81,46.8 arc-94 79.4,45.3 78.4,45.3 arc-90 76,47.7 76,50.5 arc-24 76.4,52.8 79,59.3 arc-68 81.2,60.8 81.9,60.8 arc-90 83,59.7 arc-19 82.7,57.9 81.3,53.7 arc19 81,51.7
N$25
  pour Top (isolate 0.4, no thermals): 64.5,46.8 arc-94 62.9,45.3 61.9,45.3 arc-90 59.5,47.7 59.5,50.5 arc-24 59.9,52.8 62.5,59.3 arc-68 64.7,60.8 65.4,60.8 arc-90 66.5,59.7 arc-19 66.2,57.9 64.8,53.7 arc19 64.5,51.7
  pour Bottom (isolate 0.4, no thermals): 64.5,46.8 arc-94 62.9,45.3 61.9,45.3 arc-90 59.5,47.7 59.5,50.5 arc-24 59.9,52.8 62.5,59.3 arc-68 64.7,60.8 65.4,60.8 arc-90 66.5,59.7 arc-19 66.2,57.9 64.8,53.7 arc19 64.5,51.7
N$26  (via drill 0.3)
  Top 0.25: 22.6,2.6 IC3.4 22.73,7.87 v22.6,8
  Bottom 0.25: IC1.3 22.69,8.09 v22.6,8
N$27  (via drill 0.3)
  Top 0.25: IC3.5 v24,8.6
  Bottom 0.25: v24,8.6 23.96,8.6 IC1.4
N$28  (via drill 0.3)
  Top 0.25: IC3.6 25.27,6.57 25.5,6.8 25.5,7.9 v25.4,8
  Bottom 0.25: v25.4,8 25.4,9.8 25.2,10 25.2,11.24 IC1.5
N$29  (via drill 0.3)
  Top 0.25: IC3.7 26.54,6.74 26.8,7 v26.8,8.4
  Bottom 0.25: v26.8,8.4 26.8,9.7 26.5,10 IC1.6
N$30
  pour Top (isolate 3.1, no thermals): 68.9,81.4 66.8,81.4 66.8,78.9 66.5,78.1 arc47 66.7,74.4 arc-24 67,72.7 67,66.7 arc90 68.4,65.3 68.6,65.3 arc37 69.2,65.5 arc26 71.2,68.7 71.2,74.5 arc39 70.1,76.6 68.9,78.4
  pour Bottom (isolate 3.1, no thermals): 68.9,81.4 66.8,81.4 66.8,78.9 66.5,78.1 arc47 66.7,74.4 arc-24 67,72.7 67,66.7 arc90 68.4,65.3 68.6,65.3 arc37 69.2,65.5 arc26 71.2,68.7 71.2,74.5 arc39 70.1,76.6 68.9,78.4
N$31  (via drill 0.3)
  Top 0.25: IC3.8 27.81,6.61 28.2,7 v28.2,7.8
  Bottom 0.25: v28.2,7.8 28.2,9.6 27.8,10 27.8,11.24 IC1.7
N$32  (via drill 0.3)
  Top 0.25: v37.7,5.7 37.7,4.2 37.4,3.9 37.4,2.62 IC4.1
  Bottom 0.25: IC2.15 39.96,5.84 39.25,6.55 38.2,6.55 37.7,6.05 v37.7,5.7
N$33
  pour Top (isolate 3.1, no thermals): 53.9,81.4 51.3,81.4 51,77.7 50.5,76.9 50.5,66.7 arc90 51.9,65.3 52.1,65.3 arc37 52.7,65.5 arc26 54.7,68.7 54.7,76.8 53.9,77.9
  pour Bottom (isolate 3.1, no thermals): 53.9,81.4 51.3,81.4 51,77.7 50.5,76.9 50.5,66.7 arc90 51.9,65.3 52.1,65.3 arc37 52.7,65.5 arc26 54.7,68.7 54.7,76.8 53.9,77.9
N$34  (via drill 0.3)
  Top 0.25: IC4.2 38.7,2.69 38.7,4.2 39.2,4.7 v39.2,9.8
  Bottom 0.25: v39.2,9.8 39.2,10 38.7,10.5 IC2.1
N$35  (via drill 0.3)
  Top 0.25: IC4.3 40,2.54 40,4.2 40.5,4.7 v40.5,9.8
  Bottom 0.25: v40.5,9.8 40.5,10 40,10.5 40,11.23 IC2.2
N$36  (via drill 0.3)
  Top 0.25: IC4.4 41.2,2.57 41.2,4.2 41.75,4.75 v41.75,9.8
  Bottom 0.25: v41.75,9.8 41.75,10.05 41.2,10.6 41.2,11.24 IC2.3
N$37  (via drill 0.3)
  Top 0.25: v36.45,9.3 36.2,9 C9.1 R3.1
  Bottom 0.25: IC1.10 27.77,4.43 28.5,3.7 29.7,3.7 35.05,9.05 36.05,9.05 36.3,9.3 v36.45,9.3 36.55,9.3 36.8,9.05 43.65,9.05 46.31,6.39 IC2.10
N$38
  Bottom 0.25: P2.5 81.2,9.03 81.2,10.9 78,14.1 68.4,14.1 67,12.7 67,11.4 66.4,10.8 64,10.8 R1.1
N$39
  Bottom 0.25: P2.4 76.83,13.4 72.4,13.4 R2.1
N$40  (via drill 0.3)
  Top 0.6: P2.1 77.42,2.32 D1.1 77.5,2.22 77.5,1.7 77.4,1.6 77.4,2.3 77,2.7 v75,2.7 | P1.1 58.62,5 X7.P$1 61.52,6.02 63.2,7.7 67.8,7.7 70.3,5.2 70.3,4.7 v71.3,3.7
  Bottom 0.6: v71.3,3.7 72.3,2.7 v75,2.7
N$41
  Bottom 0.25: P2.10 86.3,8.99 84.49,8.99 83.8,8.3 83.8,7.3 83,6.5 81.8,6.5 81.2,7.1 81.2,8.2 80.4,9 75.7,9 75.4,8.7 73.15,8.7 R4.1
N$42
  Top 0.6: D1.2 73.29,2.7 | 73.29,2.7 73.29,6.14 P2.2 | P1.2 64.42,5 X7.P$2 68.5,5 70.8,2.7 73.29,2.7
N$43
  Bottom 0.25: R5.1 C7.1
N$44
  Bottom 0.25: C8.1 R6.1
N$45
  Bottom 0.25: R7.1 74.45,5.55 C10.1
REL_A1
  Top 0.4: 20.2,12.41 IC3.17
  Top 0.5: 20.2,12.41 20.2,14.1 19.5,14.8 16.7,14.8 13.93,17.57 K1.1 13.75,20.41 K7.1
REL_A2
  Top 0.5: IC3.15 22.73,14.77 22,15.5 22,18.6 23.4,20 26.1,20 27.7,21.6 K8.1
  Bottom 0.5: K2.1 30.25,20.41 K8.1
REL_A3
  Top 0.5: K9.1 43.96,23.2 40.6,23.2 39.8,22.4 39.8,21 38.8,20 32.5,20 31.7,19.2 29.3,19.2 27.8,17.7 27.8,16.7 25.27,14.17 IC3.13
  Bottom 0.5: K3.1 46.75,20.41 K9.1
REL_A4
  Top 0.5: IC3.11 27.81,13.81 28.7,14.7 31.7,14.7 33,16 37.6,16 40.8,19.2 47.5,19.2 48.4,20.1 59.1,20.1 60.6,21.6 K10.1
  Bottom 0.5: K4.1 63.25,20.41 K10.1
REL_A5
  Top 0.4: 78.6,21.6 K11.1
  Top 0.5: IC4.17 38.69,14.09 40.5,15.9 59.1,15.9 62.3,19.1 64.1,19.1 65,20 77,20 78.6,21.6
  Bottom 0.5: K5.1 79.75,20.41 K11.1
REL_A6
  Top 0.5: IC4.15 41.23,13.83 41.7,14.3 64,14.3 65.6,15.9 94.58,15.9 K6.1 96.25,20.41 K12.1
REL_B1
  Top 0.5: IC3.18 15.4,12.4 11.9,15.9 5.42,15.9 K1.2 3.75,20.41 K7.2
REL_B2
  Top 0.5: IC3.16 21.46,14.57 20.25,15.78 K2.2 20.25,20.41 K8.2
REL_B3
  Top 0.5: IC3.14 24,15.5 23.2,16.3 23.2,18.2 24.2,19.2 26.6,19.2 27.4,20 30.3,20 31.9,21.6 K9.2
  Bottom 0.5: K3.2 36.75,20.41 K9.2
REL_B4
  Top 0.5: K10.2 48.5,21.6 46.9,20 40.2,20 39.4,19.2 34.5,19.2 30.9,15.6 28.2,15.6 26.54,13.94 IC3.12
  Bottom 0.5: K4.2 53.25,20.41 K10.2
REL_B5  (via drill 0.6)
  Top 0.5: IC4.18 37.42,14.32 v39,15.9 | v48.8,17.1 50.9,19.2 59.7,19.2 60.5,20 63.4,20 65,21.6 K11.2
  Bottom 0.5: v39,15.9 47.6,15.9 v48.8,17.1 | K5.2 69.75,20.41 K11.2
REL_B6
  Top 0.5: IC4.16 39.96,14.06 41,15.1 63.3,15.1 67.4,19.2 84.62,19.2 | 84.62,19.2 K6.2 | 84.62,19.2 87.03,21.6 K12.2
V+  (via drill 0.6)
  Top 0.7: IC4.10 47.58,9.12 48.2,8.5 C4.1 | IC3.10 29.08,9.12 29.7,8.5 C3.1
  Top 1: C4.1 51.96,8.5 C2.+ | C3.1 31.15,8.5 31.2,8.55 v31.2,11.8
  Bottom 0.6: K5.5 K11.3 | K6.5 K12.3 | K3.5 K9.3
  Bottom 1: K8.3 K2.5 27.32,15.5 29.4,15.5 31.2,13.95 v31.2,11.8 | C2.+ 58.25,14.79 K4.5 K10.3
  Bottom 2: C1.+ 8.75,13.29 K1.5 K7.3 P3.MP 20.35,26.4 25.25,26.4 | 25.25,26.4 41.75,26.4 | 41.75,26.4 52.4,26.4 54,24.8 58.25,24.8 | 58.25,24.8 74.75,24.8 | K11.3 74.75,24.8 | K8.3 25.25,26.4 | K9.3 41.75,26.4 | K10.3 58.25,24.8 | K12.3 88.45,24.4 86.2,24.4 84.6,22.8 81.8,22.8 79.8,24.8 74.75,24.8
VCC  (via drill 0.3)
  Top 0.4: 35.2,0.8 v35.2,2.5 35.2,4.2 35.1,4.3 R3.2
  Top 0.6: v16.6,4.5 16.8,4.3 16.8,2.1 18.1,0.8 35.2,0.8 68.7,0.8 v69.3,1.4
  Bottom 0.4: IC2.16 38.69,3.39 37.8,2.5 C6.1 v35.2,2.5 | v16.6,4.5 C5.1 20.1,4.5 20.15,4.55 IC1.16
  Bottom 0.6: v69.3,1.4 69.35,1.35 75.95,1.35 79.96,5.36 P2.3

### Text on the board
Bottom: out6-cs-bot V1.0 www.selfbus.org | BOT
tDocu: Pos 11, 12
_tplace: + | 18L | 10 | 18L | 10 | 2 | 1 | 1 | 9 | 1 | 9 | 10